# EAGLE schematic fonte (EAGLE 6.5.0)
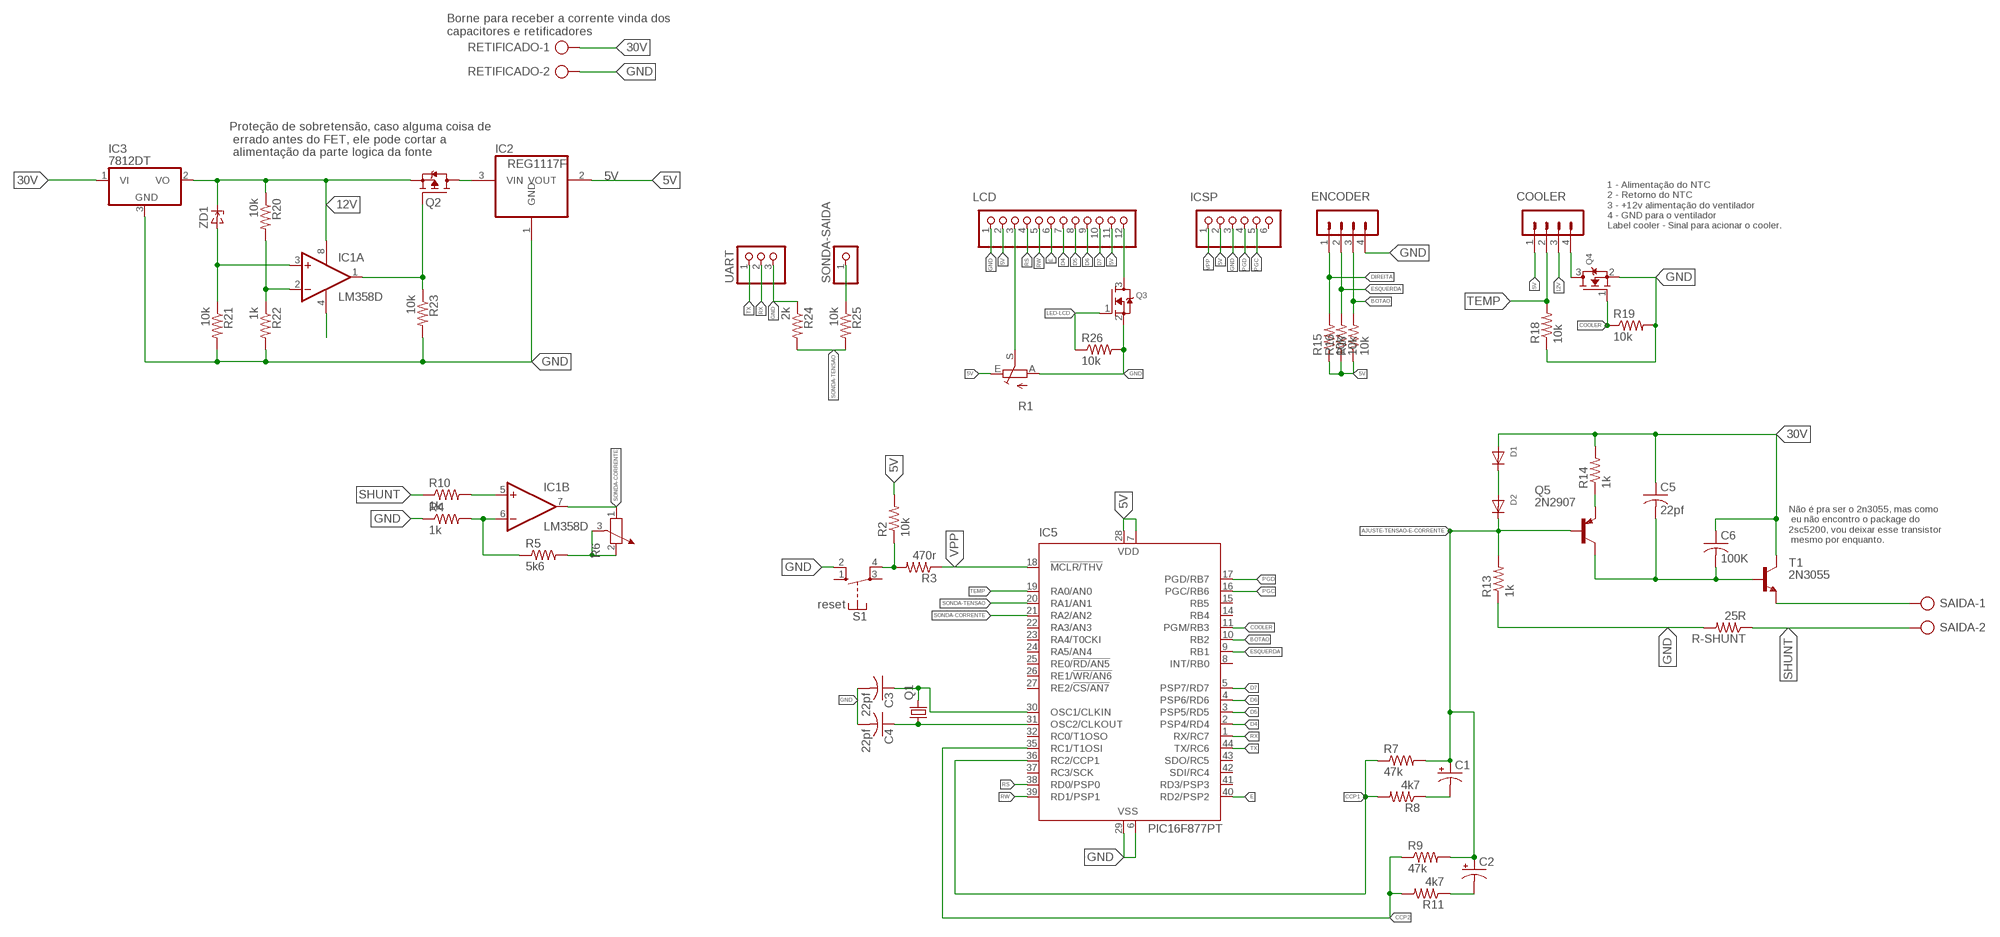
[diagram p0: schematic, sheet 1]

## Parts
C1  CPOL-US140CLH-1010  [140CLH-1010]
C2  CPOL-US140CLH-1010  [140CLH-1010]
C3  22pf  C-USC1812  [C1812]
C4  22pf  C-USC1812  [C1812]
C5  22pf  C-USC1812  [C1812]
C6  100K  C-USC1812  [C1812]
COOLER  MA04-1  [MA04-1]
D1  DIODESOD-123  [SOD-123]
D2  DIODESOD-123  [SOD-123]
ENCODER  MA04-1  [MA04-1]
IC1  LM358D  [SO08]
IC2  REG1117F  [DD-3]
IC3  7812DT  [TO252]
IC5  PIC16F877PT  [TQFP44]
ICSP  PINHD-1X6B  [1X06-BIG]
LCD  PINHD-1X12-CB  [1X12-CB]
Q1  CRYSTALHC49UP  [HC49UP]
Q2  BSA223SP  [SC75_INFINEON]
Q3  MOSFET-NREFLOW  [SOT23]
Q4  MOSFET-NREFLOW  [SOT23]
Q5  2N2907  [TO92-EBC-OVAL]
R1  TRIM_EU-LI15  [LI15]
R2  10k  R-US_R0603  [R0603]
R3  470r  R-US_R0603  [R0603]
R4  1k  R-US_R0603  [R0603]
R5  5k6  R-US_R0603  [R0603]
R6  POTENTIOMETER_PT-10  [PT-10]
R7  47k  R-US_R0603  [R0603]
R8  4k7  R-US_R0603  [R0603]
R9  47k  R-US_R0603  [R0603]
R10  1k  R-US_R0603  [R0603]
R11  4k7  R-US_R0603  [R0603]
R13  1k  R-US_R0603  [R0603]
R14  1k  R-US_R0603  [R0603]
R15  10k  R-US_R0603  [R0603]
R16  10k  R-US_R0603  [R0603]
R17  10k  R-US_R0603  [R0603]
R18  10k  R-US_R0603  [R0603]
R19  10k  R-US_R0603  [R0603]
R20  10k  R-US_R0603  [R0603]
R21  10k  R-US_R0603  [R0603]
R22  1k  R-US_R0603  [R0603]
R23  10k  R-US_R0603  [R0603]
R24  2k  R-US_R0603  [R0603]
R25  10k  R-US_R0603  [R0603]
R26  10k  R-US_R0603  [R0603]
R-SHUNT  25R  R-US_R0603  [R0603]
RETIFICADO  AK300/2  [AK300/2]
S1  reset  RACON12  [RACON12]
SAIDA  AK300/2  [AK300/2]
SONDA-SAIDA  PINHD-1X1  [1X01]
T1  2N3055  [TO3]
UART  PINHD-1X3CB  [1X03-CLEANBIG]
ZD1  ZENERSOD-123  [SOD-123]

## Nets
5V: COOLER.1 IC2.2(VOUT) IC5.7(VDD) IC5.28(VDD) ICSP.2 LCD.2 LCD.11 R1.E R2.2 R15.1 R16.1 R17.1
12V: COOLER.3 IC1.8(P:V+) IC3.2(VO) Q2.3(S) R20.1 ZD1.C
30V: C5.1 C6.1 D1.A IC3.1(VI) R14.2 RETIFICADO.1 T1.C T1.C/(C)
AJUSTE-TENSAO-E-CORRENTE: C1.+ C2.+ D2.C Q5.B R7.2 R9.2 R13.2
BOTAO: ENCODER.3 IC5.10(RB2) R17.2
CCP1: IC5.36(RC2/CCP1) R7.1 R8.2
CCP2: IC5.35(RC1/T1OSI) R9.1 R11.2
COOLER: IC5.11(PGM/RB3) Q4.1(G) R19.1
D4: IC5.2(PSP4/RD4) LCD.7
D5: IC5.3(PSP5/RD5) LCD.8
D6: IC5.4(PSP6/RD6) LCD.9
D7: IC5.5(PSP7/RD7) LCD.10
DIREITA: ENCODER.1 R15.2
E: IC5.40(RD2/PSP2) LCD.6
ESQUERDA: ENCODER.2 IC5.9(RB1) R16.2
GND: C1.- C2.- C3.2 C4.2 ENCODER.4 IC2.1(GND) IC3.3(GND) IC5.6(VSS) IC5.29(VSS) ICSP.3 LCD.1 Q3.2(S) Q4.2(S) R1.A R4.1 R8.1 R11.1 R13.1 R18.1 R19.2 R21.2 R22.2 R23.2 R24.1 R26.2 R-SHUNT.2 RETIFICADO.2 S1.2(S) UART.3
LED-LCD: Q3.1(G) R26.1
N$1: R2.1 R3.2 S1.4(P)
N$2: LCD.12 Q3.3(D)
N$3: SAIDA.1 T1.E
N$4: C4.1 IC5.31(OSC2/CLKOUT) Q1.1
N$5: C3.1 IC5.30(OSC1/CLKIN) Q1.2
N$6: IC1.2(A:-IN) R20.2 R22.1
N$7: IC1.3(A:+IN) R21.1 ZD1.A
N$8: R25.1 SONDA-SAIDA.1
N$9: IC1.5(B:+IN) R10.2
N$10: LCD.3 R1.S
N$11: IC1.1(A:OUT) Q2.1(G) R23.1
N$12: IC2.3(VIN) Q2.2(D)
N$13: IC1.6(B:-IN) R4.2 R5.1
N$14: R5.2 R6.2 R6.3
N$15: COOLER.4 Q4.3(D)
N$16: Q5.E R14.1
N$17: IC1.4(P:V-)
N$19: D1.C D2.A
N$23: C5.2 C6.2 Q5.C T1.B
PGC: IC5.16(PGC/RB6) ICSP.5
PGD: IC5.17(PGD/RB7) ICSP.4
RS: IC5.38(RD0/PSP0) LCD.4
RW: IC5.39(RD1/PSP1) LCD.5
RX: IC5.1(RX/RC7) UART.2
SHUNT: R10.1 R-SHUNT.1 SAIDA.2
SONDA-CORRENTE: IC1.7(B:OUT) IC5.21(RA2/AN2) R6.1
SONDA-TENSAO: IC5.20(RA1/AN1) R24.2 R25.2
TEMP: COOLER.2 IC5.19(RA0/AN0) R18.2
TX: IC5.44(TX/RC6) UART.1
VPP: IC5.18(!MCLR/THV) ICSP.1 R3.1
Unconnected: IC5.8(INT/RB0) IC5.14(RB4) IC5.15(RB5) IC5.22(RA3/AN3) IC5.23(RA4/T0CKI) IC5.24(RA5/AN4) IC5.25(RE0/!RD/AN5) IC5.26(RE1/!WR/AN6) IC5.27(RE2/!CS/AN7) IC5.32(RC0/T1OSO) IC5.37(RC3/SCK) IC5.41(RD3/PSP3) IC5.42(SDI/RC4) IC5.43(SDO/RC5) ICSP.6 S1.1(S) S1.3(P)

## Notes on the sheet
- Borne para receber a corrente vinda dos 
  capacitores e retificadores
- Proteção de sobretensão, caso alguma coisa de
   errado antes do FET, ele pode cortar a
   alimentação da parte logica da fonte
- 1 - Alimentação do NTC
  2 - Retorno do NTC
  3 - +12v alimentação do ventilador
  4 - GND para o ventilador
  Label cooler - Sinal para acionar o cooler.
- Não é pra ser o 2n3055, mas como
   eu não encontro o package do 
  2sc5200, vou deixar esse transistor
   mesmo por enquanto.

## Library data of the parts
C1 C2 = adafruit:CPOL-US: POLARIZED CAPACITOR, American symbol
C3-C6 = adafruit:C-US: CAPACITOR, American symbol
COOLER ENCODER = con-lstb:MA04-1: PIN HEADER; OC_FARNELL: unknown; OC_NEWARK: unknown
D1 D2 = adafruit:DIODE: Diode SMADIODE - SMA Surface Mount Package 20V 1A Schottky Diode Digikey: 641-1014-6-ND DO-1N4148 - Through Hole Small Current Diode SOD-123 20V 1 A (.5mV Vf) Schottky Diode - Digikey: MBRX120TPMSCT-ND SOD-323 10V 570mA (.38mV Vf, 3ns) Schottky Diode - Digikey: ZLLS410CT-ND SOD-523 30V 30mA Schottky Diode (RB751S-40TE61) - Digikey: RB751S-40TE61CT-ND SOT23-R/W - SOT23 Package (R = Solder Paste/Reflow Ovens, W = Hand-Soldering) BAT54Film 40V 300mA - Digikey: 497-7162-1-ND
IC1 = linear:LM358: OP AMP also LM158; LM258; LM2904 Source: http://cache.national.com/ds/LM/LM158.pdf
IC2 = burr-brown:REG1117: 800mA and 1A Low Dropout (LDO) Positive Regulator 1.8V, 2.5V, 2.85V, 3.3V, 5V, and Adj; MF: TEXAS INSTRUMENTS; MPN: REG1117FAKTTT; OC_FARNELL: 1296120; OC_NEWARK: 87H2562
IC3 = adafruit:78*: Positive VOLTAGE REGULATOR Added bigger pads to the TO-92 package
IC5 = microchip:PIC16F87*: MICROCONTROLLER; MF: MICROCHIP; MPN: PIC16F877-04/PQ; OC_FARNELL: 9761411; OC_NEWARK: 23C5094
ICSP = adafruit:PINHD-1X6: PIN HEADER
LCD = adafruit:PINHD-1X12: PIN HEADER
Q1 = adafruit:CRYSTAL: CRYSTAL; OC_FARNELL: unknown; OC_NEWARK: unknown
Q2 = transistor-fet:BSA223SP: OptiMOS(R)-P Small-Signal-Transistor P-Channel, Enhancement mode, Super Logic Level (2.5 V rated) Source: http://www.infineon.com/upload/Document/BSA223SP_Rev1.3.pdf
Q3 Q4 = adafruit:MOSFET-N: N-Channel Mosfet 2N7002E - 60V 260mA SOT23 [Digikey: 2N7002ET1GOSTR-ND] - REEL BSH103 - 30V 850mA SOT23 [Digikey: 568-5013-1-ND]
Q5 = adafruit:2N2907*: PNP Transistor Big Oval pads
R1 = pot:TRIM_EU-: POTENTIOMETER
R2-R5 R7-R11 R13-R26 R-SHUNT = adafruit:R-US_: RESISTOR, American symbol
R6 = rcl:POTENTIOMETER_: Potentiometer
RETIFICADO SAIDA = con-ptr500:AK300/2: CONNECTOR; OC_FARNELL: unknown; OC_NEWARK: unknown
S1 = switch-misc:RACON12: ITT SWITCH
SONDA-SAIDA = adafruit:PINHD-1X1: Pin header 1x1 for 0.1" spacing With round pins
T1 = transistor:2N3055: NPN TRANSISTOR
UART = adafruit:PINHD-1X3: PIN HEADER
ZD1 = dp_devices:ZENER: Zener Diode SOD-323